# Altium schematic sheet Power.SchDoc: Power
size A4; Date: Not used; ApprovedBy: Not used; CheckedBy: Not used; Author: Not used; CompanyName: STMicroelectronics; DrawnBy: Not used; Engineer: Not used; Organization: Not used; Address1: Not used; Address2: Not used; Address3: Not used; Address4: Not used; DocumentNumber: Not used; Revision: Not used; SheetNumber: 9; SheetTotal: 12; CurrentTime: Not used; CurrentDate: Not used; Time: Not used; DocumentFullPathAndName: Not used; DocumentName: Not used; ModifiedDate: Not used; ImagePath: Not used; ProjectName: Not used; Application_BuildNumber: Not used
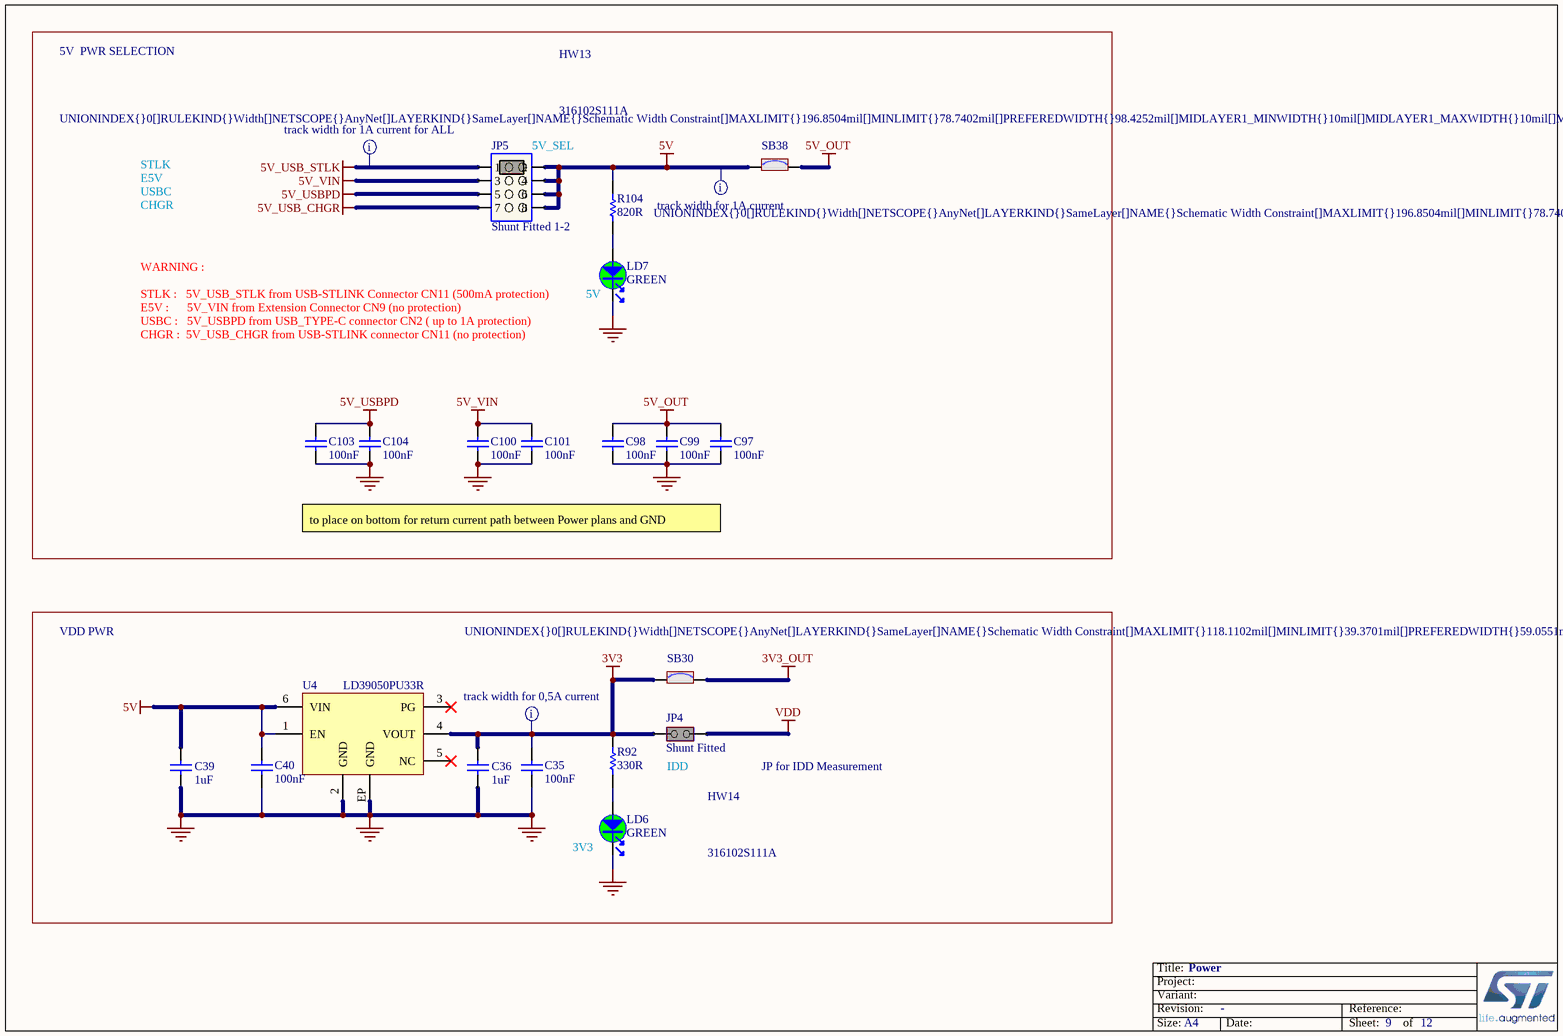
[diagram p0: Power.SchDoc]

## Parts
C35  value 100nF  [C0402]
C36  value 1uF  [C0603]
C39  value 1uF  [C0603]
C40  value 100nF  [C0402]
C97  value 100nF  [C0402]
C98  value 100nF  [C0402]
C99  value 100nF  [C0402]
C100  value 100nF  [C0402]
C101  value 100nF  [C0402]
C103  value 100nF  [C0402]
C104  value 100nF  [C0402]
HW13  value 316102S111A  (hidden comment: JUMPER_OPEN)
HW14  value 316102S111A  (hidden comment: JUMPER_OPEN)
JP4  value Shunt Fitted  [CON_988-JIUBABA_313102S111116]  (hidden comment: Jumper_Header 2x1 Fitted)
JP5  value Shunt Fitted 1-2  [CON_988-JIUBABA_313208S141116]  (hidden comment: Jumper_Header 4x2 Fitted 1-2)
LD6  value GREEN  [LED_0603_GREEN]
LD7  value GREEN  [LED_0603_GREEN]
R92  value 330R  [R0603]
R104  value 820R  [R0603]
SB30  (no value)  [SOLDER-BRIDGE_R0603-0R]
SB38  (no value)  [SOLDER-BRIDGE_R0603-0R]
U4  value LD39050PU33R  [ICC_DFN6-EPAD_3X3_P095]

## Nets
3V3: C35.2 C36.2 JP4.1(COMMON) R92.2 SB30.1 U4.4(VOUT)
3V3_OUT: SB30.2
5V: C39.2 C40.2 JP5.2 JP5.4 JP5.6 JP5.8 R104.2 SB38.1 U4.1(EN) U4.6(VIN)
5V_OUT: C97.2 C98.2 C99.2 SB38.2
5V_USB_CHGR: JP5.7
5V_USB_STLK: JP5.1
5V_USBPD: C103.2 C104.2 JP5.5
5V_VIN: C100.2 C101.2 JP5.3
GND: C35.1 C36.1 C39.1 C40.1 C97.1 C98.1 C99.1 C100.1 C101.1 C103.1 C104.1 LD6.2 LD7.2 U4.2(GND) U4.EP(GND)
VDD: JP4.2(NO)
NetLD6_1: LD6.1 R92.1
NetLD7_1: LD7.1 R104.1

Not connected (* = marked no-connect by the designer): U4 3(PG)* 5(NC)*

## Layout directives
rule Width Constraint [Pref Width = 2.5mm    Min Width = 2mm    Max Width = 5mm]: 5V, 5V_USB_STLK
rule Width Constraint [Pref Width = 1.5mm    Min Width = 1mm    Max Width = 3mm]: 3V3

## Notes on the sheet
- 5V  PWR SELECTION
- STLK
- E5V
- (near JP5) 5V_SEL
- USBC
- CHGR
- (near LD7) STLK :   5V_USB_STLK from USB-STLINK Connector CN11 (500mA protection)
- E5V :      5V_VIN from Extension Connector CN9 (no protection)
- WARNING :
- (near LD7) 5V
- USBC :   5V_USBPD from USB_TYPE-C connector CN2 ( up to 1A protection)
- CHGR :  5V_USB_CHGR from USB-STLINK connector CN11 (no protection)
- to place on bottom for return current path between Power plans and GND
- VDD PWR
- IDD
- JP for IDD Measurement
- (near LD6) 3V3
- Title:
- Project:
- Size:
- Revision:
- Variant:
- A4
- -
- Date:
- Reference:
- Sheet:
- of

## Library data of the parts
C35 C40 C97-C101 C103 C104 = MCD-00102: Capacitor, MLCC, 100nF, 16V, X7R, 10%, 0402, T=0,5mm; Manufacturer_Part_Number: CC0402KRX7R7BB104; Manufacturer: YAGEO; Alternate_Manufacturer_Part_Number: GCM155R71C104KA55D; Alternate_Manufacturer: MURATA; Provided_By: SUBCO; Internal_Part_Number: MCD-00102; Status: Released; Package: C0402; ComponentLink1Description: Datasheet; Part_Type: Capacitor; ComponentLink1URL: http://tunmcdsvn.tun.st.com/Component_Datasheet_Library/Trunk/Capacitors/Yageo_Multilayer_Capacitor_X7R_series_100pF_to_22uF
C36 C39 = MCD-00010: Capacitor, MLCC, 1uF, 16V, X5R, 10%, 0603, T=0,8mm; Manufacturer_Part_Number: CC0603KRX5R7BB105; Manufacturer: YAGEO; Provided_By: SUBCO; Internal_Part_Number: MCD-00010; Status: Released; Package: C0603; ComponentLink1Description: Datasheet; Part_Type: Capacitor; ComponentLink1URL: http://tunmcdsvn.tun.st.com/Component_Datasheet_Library/Trunk/Capacitors/Yageo_Multilayer_capacitor_X5R_series_100pF_to_100uF
HW13 HW14 = MCD-01849: Jumper, height 6mm, Black, 2.54mm, 3A, 20 mohm, open; Part_Type: Mechanical; Manufacturer: JIUBABA; Provided_By: SUBCO; Internal_Part_Number: MCD-01849; Status: Footprint available; Manufacturer_Part_Number: 316102S111A; ComponentLink1Description: Datasheet; ComponentLink1URL: http://tunmcdsvn.tun.st.com/Component_Datasheet_Library/Trunk/Mechanical/JIUBABA_316102S111A_Jumper_open_2.54mm/JIUBABA_316102S111A_Jumper_open__2.54mm.pdf; ECCN_US: n/a; ECCN_EU: n/a
JP4 = MCD-01662: Header 2x1, 2.54mm, VR, TH, height 6 mm / 3 mm, total 11.6mm - Shunt Fitted by default; Part_Type: Connector; Manufacturer_Part_Number: 313102S111116; Manufacturer: JIUBABA; Provided_By: SUBCO; Internal_Part_Number: MCD-01662; Status: Footprint available; ComponentLink1Description: Datasheet; ComponentLink1URL: http://tunmcdsvn.tun.st.com/Component_Datasheet_Library/Trunk/Connectors/JIUBABA_31XXX_2.54mm_L11.6mm/JIUBABA_31XXX_2.54mm_L11.6mm.pdf
JP5 = MCD-01661: Header, 4x2, 2,54mm, VR, TH, Height 6mm/3m, total 11.6mm - Shunt Fitted 1-2; Part_Type: Connector; Manufacturer_Part_Number: 313208S141116; Manufacturer: JIUBABA; Provided_By: SUBCO; Internal_Part_Number: MCD-01661; Status: Footprint available; ComponentLink1Description: Datasheet; ComponentLink1URL: http://tunmcdsvn.tun.st.com/Component_Datasheet_Library/Trunk/Connectors/JIUBABA_31XXX_2.54mm_L11.6mm/JIUBABA_31XXX_2.54mm_L11.6mm.pdf
LD6 LD7 = MCD-00050: LED, Green, 0603; Manufacturer_Part_Number: 19-213SYGC/S530-E2/TR8; Manufacturer: EVERLIGHT; Part_Type: Display; Provided_By: SUBCO; Internal_Part_Number: MCD-00050; ComponentLink1Description: Datasheet; Status: Released; ComponentLink1URL: http://tunmcdsvn.tun.st.com/Component_Datasheet_Library/Trunk/Display/Everlight_SMD-LED-GREEN_19-213SYGC-S530-XX-TR8-v3.doc; Package: LED 0603
R92 = MCD-00197: Resistor,330R,0603,1%,1/10W; Manufacturer_Part_Number: RC0603FR-07330RL; Manufacturer: YAGEO; BMS_Part_Number: 9129729; Provided_By: SUBCO; Internal_Part_Number: MCD-00197; Status: Released; Part_Type: Resistor; Package: R0603; ComponentLink1Description: Datasheet; ComponentLink1URL: http://tunmcdsvn.tun.st.com/Component_Datasheet_Library/Trunk/Resistors/Yageo_Resistor_RC0603-series
R104 = MCD-00528: Resistor,820R,0603,1%,1/10W; Manufacturer_Part_Number: RC0603FR-07820RL; Manufacturer: YAGEO; BMS_Part_Number: 9129759; Provided_By: SUBCO; Internal_Part_Number: MCD-00528; Status: Released; Part_Type: Resistor; Package: R0603; ComponentLink1Description: Datasheet; ComponentLink1URL: http://tunmcdsvn.tun.st.com/Component_Datasheet_Library/Trunk/Resistors/Yageo_Resistor_RC0603-series
SB30 SB38 = MCD-00071: Solder Bridge ON; Part_Type: Mechanical; Manufacturer_Part_Number: RC0603JR-070RL; Manufacturer: YAGEO; Provided_By: SUBCO; Internal_Part_Number: MCD-00071; Status: Released; Package: SB0603; ComponentLink1Description: Datasheet; ComponentLink1URL: http://tunmcdsvn.tun.st.com/Component_Datasheet_Library/Trunk/Resistors/Yageo_Resistor_RC0603-series
U4 = MCD-00215: Low quiescent current and low noise voltage regulators; Manufacturer: STMICROELECTRONICS; Part_Type: IC; BMS_Part_Number: 9176126; Provided_By: SUBCO with ST control; Internal_Part_Number: MCD-00215; Manufacturer_Part_Number: LD39050PU33R; Status: Released; ComponentLink1Description: Datasheet; ComponentLink1URL: http://tunmcdsvn.tun.st.com/Component_Datasheet_Library/Trunk/IC/STM_LDO_LD39050PU; Package: DFN6 3x3mm